# Altium schematic sheet Sheet1.SchDoc
size A4; SheetNumber: 1; SheetTotal: 1; SPICEModelCacheIDHECYRS: <root> / <DocumentId>IDHECYRS</DocumentId> / <CacheFrame Number="0"> / <Model Name="led0" Kind="MDL"> / <Text>*Typ INFRARED GaAs LED: Vf=1.2V Vr=5V If=40mA trr=3uS / *LED Pinout: 1=A, 2=K / .MODEL LED0 D (IS=93.5P RS=84M N=2.63 BV=5 IBV=10U / + CJO=2.97P VJ=.75 M=.333 TT=4.32U)</Text> / </Model> / </CacheFrame> / </root>
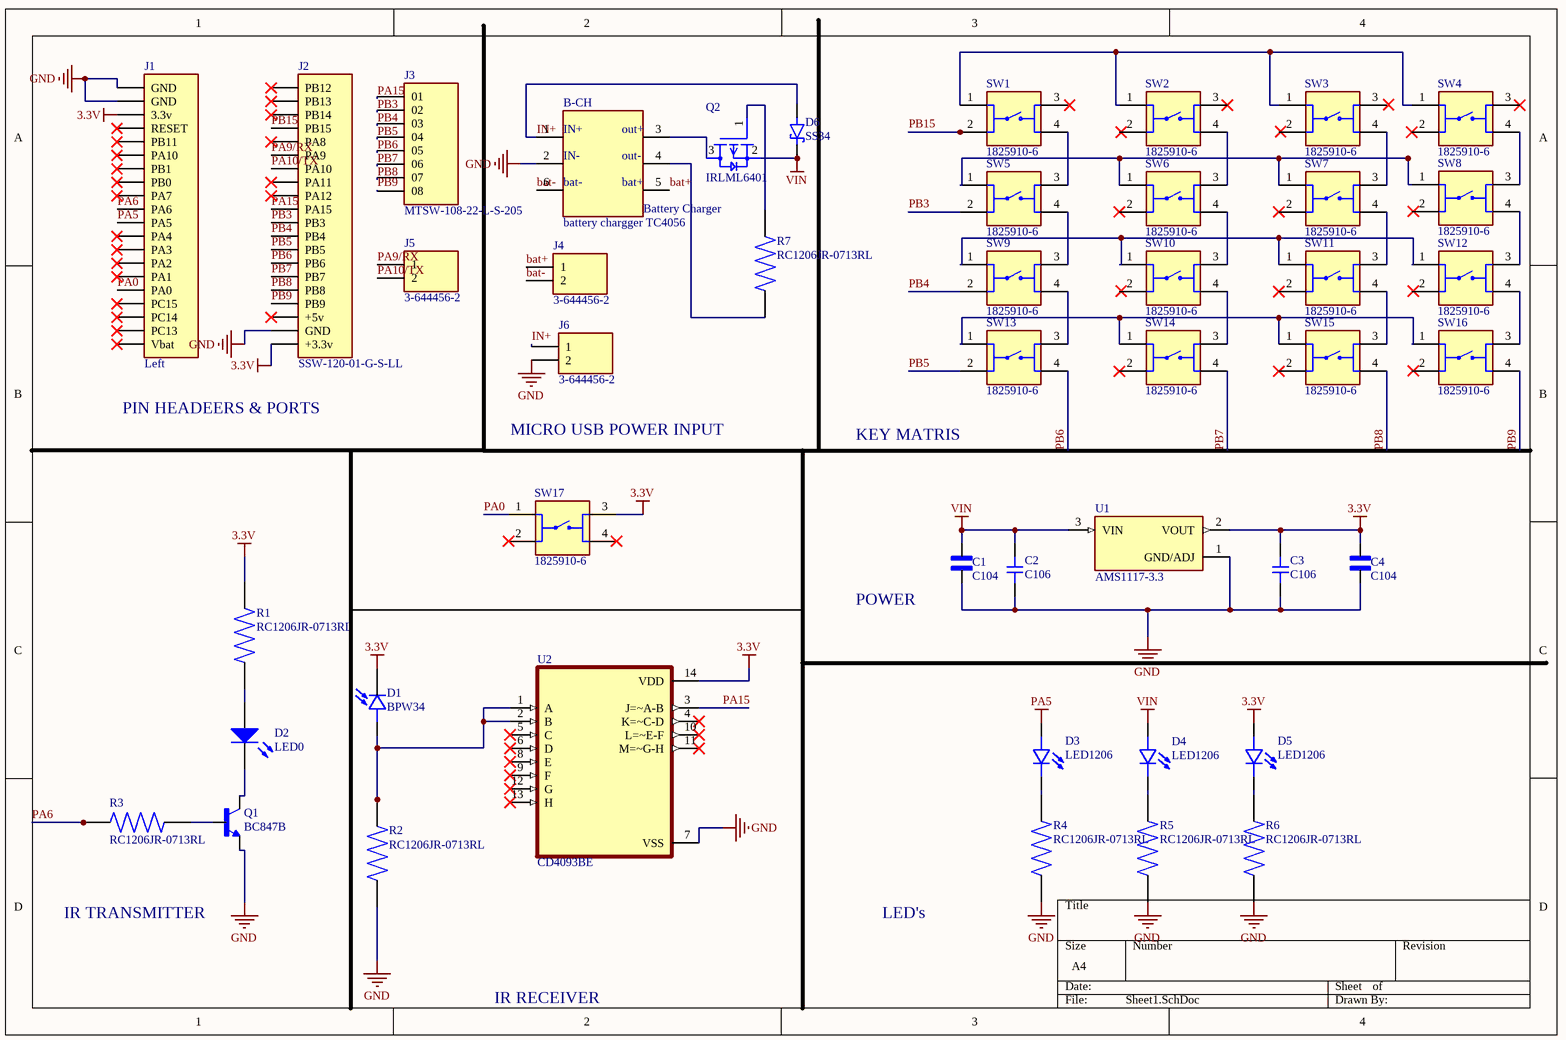
[diagram p0: Sheet1.SchDoc]

## Parts
B-CH  battery chargger TC4056  [battery charger TC4056]
C1  C104  [CAPC2012X88N]
C2  C106  [CAPC3216X120N]
C3  C106  [CAPC3216X120N]
C4  C104  [CAPC2012X88N]
D1  BPW34  [DIO_BPW34]
D2  LED0  [LED-0]
D3  LED1206  [LEDC3216X120N]
D4  LED1206  [LEDC3216X120N]
D5  LED1206  [LEDC3216X120N]
D6  SS34  [DIOM7959X265N]
J1  Left  [SAMTEC_SSW-120-01-G-S-LL]
J2  SSW-120-01-G-S-LL  [SAMTEC_SSW-120-01-G-S-LL]
J3  MTSW-108-22-L-S-205  [SAMTEC_MTSW-108-22-L-S-205]
J4  3-644456-2  [TE_3-644456-2]
J5  3-644456-2  [TE_3-644456-2]
J6  3-644456-2  [TE_3-644456-2]
Q1  BC847B  [SOT100P230X110-3N]
Q2  IRLML6401  [SOT23-3]
R1  RC1206JR-0713RL  [RESC3116X65N]
R2  RC1206JR-0713RL  [RESC3116X65N]
R3  RC1206JR-0713RL  [RESC3116X65N]
R4  RC1206JR-0713RL  [RESC3116X65N]
R5  RC1206JR-0713RL  [RESC3116X65N]
R6  RC1206JR-0713RL  [RESC3116X65N]
R7  RC1206JR-0713RL  [RESC3116X65N]
SW1  1825910-6  [SW_1825910-6-4]
SW2  1825910-6  [SW_1825910-6-4]
SW3  1825910-6  [SW_1825910-6-4]
SW4  1825910-6  [SW_1825910-6-4]
SW5  1825910-6  [SW_1825910-6-4]
SW6  1825910-6  [SW_1825910-6-4]
SW7  1825910-6  [SW_1825910-6-4]
SW8  1825910-6  [SW_1825910-6-4]
SW9  1825910-6  [SW_1825910-6-4]
SW10  1825910-6  [SW_1825910-6-4]
SW11  1825910-6  [SW_1825910-6-4]
SW12  1825910-6  [SW_1825910-6-4]
SW13  1825910-6  [SW_1825910-6-4]
SW14  1825910-6  [SW_1825910-6-4]
SW15  1825910-6  [SW_1825910-6-4]
SW16  1825910-6  [SW_1825910-6-4]
SW17  1825910-6  [SW_1825910-6-4]
U1  AMS1117-3.3  [SOT229P700X180-4N]
U2  CD4093BE  [DIP794W45P254L1969H508Q14]

## Nets
3.3V: C3.1(A) C4.1 D1.C D5.POS J1.03(3.3v) J2.?1(+3.3v) R1.2 SW17.3 U1.2(VOUT) U2.14(VDD)
GND: B-CH.2 C1.2 C2.2(B) C3.2(B) C4.2 J1.01(GND) J1.02(GND) J2.19(GND) J6.2 Q1.2(E) R2.1 R4.1 R5.1 R6.1 U1.1(GND/ADJ) U2.7(VSS)
PA5: D3.POS J1.11(PA5)
VIN: C1.1 C2.1(A) D4.POS D6.C(K) Q2.2(S) U1.3(VIN)
bat+: B-CH.5 J4.1
bat-: B-CH.6 J4.2
IN+: B-CH.1 D6.A J6.1
PA0: J1.16(PA0) SW17.1
PA6: J1.10(PA6) R3.2
PA9/RX: J2.06(PA9) J5.1
PA10/TX: J2.07(PA10) J5.2
PA15: J2.10(PA15) J3.01 U2.3(J=~A-B)
PB3: J2.11(PB3) J3.02 SW5.2
PB4: J2.12(PB4) J3.03 SW9.2
PB5: J2.13(PB5) J3.04 SW13.2
PB6: J2.14(PB6) J3.05 SW13.4
PB7: J2.15(PB7) J3.06 SW14.4
PB8: J2.16(PB8) J3.07 SW15.4
PB9: J2.17(PB9) J3.08 SW16.4
PB15: J2.04(PB15) SW1.2
NetB-CH_3: B-CH.3 Q2.3(D)
NetB-CH_4: B-CH.4 R7.1
NetD1_A: D1.A R2.2 U2.1(A) U2.2(B)
NetD2_1: D2.1(A) R1.1
NetD2_2: D2.2(K) Q1.3(C)
NetD3_NEG: D3.NEG R4.2
NetD4_NEG: D4.NEG R5.2
NetD5_NEG: D5.NEG R6.2
NetQ1_1: Q1.1(B) R3.1
NetQ2_1: Q2.1(G) R7.2
NetSW1_1: SW1.1 SW2.1 SW3.1 SW4.1
NetSW1_4: SW1.4 SW5.3
NetSW2_4: SW2.4 SW6.3
NetSW3_4: SW3.4 SW7.3
NetSW4_4: SW4.4 SW8.3
NetSW5_1: SW5.1 SW6.1 SW7.1 SW8.1
NetSW5_4: SW5.4 SW9.3
NetSW6_4: SW6.4 SW10.3
NetSW7_4: SW7.4 SW11.3
NetSW8_4: SW8.4 SW12.3
NetSW9_1: SW9.1 SW10.1 SW11.1 SW12.1
NetSW9_4: SW9.4 SW13.3
NetSW10_4: SW10.4 SW14.3
NetSW11_4: SW11.4 SW15.3
NetSW12_4: SW12.4 SW16.3
NetSW13_1: SW13.1 SW14.1 SW15.1 SW16.1

Not connected (* = marked no-connect by the designer): J1 04(RESET)* 05(PB11)* 06(PA10)* 07(PB1)* 08(PB0)* 09(PA7)* 12(PA4)* 13(PA3)* 14(PA2)* 15(PA1)* 17(PC15)* 18(PC14)* 19(PC13)* 20(Vbat)*; J2 01(PB12)* 02(PB13)* 03(PB14)* 05(PA8)* 08(PA11)* 09(PA12)* 18(+5v)*; SW1 3; SW2 2 3*; SW3 2 3; SW4 2* 3*; SW6 2*; SW7 2*; SW8 2; SW10 2; SW11 2*; SW12 2; SW14 2*; SW15 2*; SW16 2; SW17 2* 4*; U2 4(K=~C-D)* 5(C)* 6(D)* 8(E)* 9(F)* 10(L=~E-F)* 11(M=~G-H)* 12(G)* 13(H)*

## Notes on the sheet
- PIN HEADEERS & PORTS
- MICRO USB POWER INPUT
- KEY MATRIS
- POWER
- IR TRANSMITTER
- LED's
- IR RECEIVER
- (in symbol battery chargger TC4056) IN+; out+; IN-; out-; bat-; bat+; Battery Charger

## Library data of the parts
C1 C4 = C0805C475K3PACTU: Capacitor;Ceramic;Cap 4.7uF;Tol+10%;SMT;Vol-Rtg 25V;X5R;TR | KEMET C0805C475K3PACTU; SnapEDA_Link: https://www.snapeda.com/parts/C0805C475K3PACTU/KEMET/view-part/?ref=snap; Package: 0805 Kemet; Value: *; MF: KEMET; MP: C0805C475K3PACTU; Check_prices: https://www.snapeda.com/parts/C0805C475K3PACTU/KEMET/view-part/?ref=eda
C2 C3 = C1206C105K5RACTU: 1206 C 1uF Ceramic Multilayer Capacitor, 50 VDC, +125degC, X7R Dielec, +/-10% | KEMET C1206C105K5RACTU; SnapEDA_Link: https://www.snapeda.com/parts/C1206C105K5RACTU/KEMET/view-part/?ref=snap; Package: 1206-2 KEMET; Value: *; MF: KEMET; MP: C1206C105K5RACTU; Check_prices: https://www.snapeda.com/parts/C1206C105K5RACTU/KEMET/view-part/?ref=eda
D1 = BPW34: Photodiode 850nm 20ns 120Â° 2-DIP (0.213, 5.40mm); MF: OSRAM Opto Semiconductors; SnapEDA_Link: https://www.snapeda.com/parts/BPW%2034/OSRAM/view-part/?ref=snap; Package: SMD-2 OSRAM Opto Semiconductors; Value: *; MP: BPW 34; Check_prices: https://www.snapeda.com/parts/BPW%2034/OSRAM/view-part/?ref=eda
D2 = LED0: Typical INFRARED GaAs LED; Published: 8-Jun-2000; LatestRevisionDate: 08-Jul-2005; LatestRevisionNote: Mech Layer 1 removed.; PackageReference: LED-0; Publisher: Altium Limited
D3-D5 = LHN974_RED_LED_1206: 2.6 V Red LED SMD; MF: Osram; MP: LHN974 RED LED 1206; SnapEDA_Link: https://www.snapeda.com/parts/LHN974%20RED%20LED%201206/Osram/view-part/?ref=snap; Package: None; Value: *; Check_prices: https://www.snapeda.com/parts/LHN974%20RED%20LED%201206/Osram/view-part/?ref=eda
D6 = SS34: Diode Schottky 40 V 3A Surface Mount SMC (DO-214AB); MF: onsemi; SnapEDA_Link: https://www.snapeda.com/parts/SS34/Onsemi/view-part/?ref=snap; Package: SMC-2 ON Semiconductor; Value: *; MP: SS34; Check_prices: https://www.snapeda.com/parts/SS34/Onsemi/view-part/?ref=eda
J1 J2 = SSW-120-01-G-S-LL: MF: Samtec; Value: *; Price: None; Availability: Unavailable; Package: None; MP: SSW-120-01-G-S-LL
J4-J6 = 3-644456-2: HEADER ASSEMBLY, NARROW, MTA-100, 2 POSITION, STRAIGHT | TE Connectivity 3-644456-2; SnapEDA_Link: https://www.snapeda.com/parts/3-644456-2/TE+Connectivity+AMP+Connectors/view-part/?ref=snap; Package: None; Value: *; MF: TE Connectivity; MP: 3-644456-2; Check_prices: https://www.snapeda.com/parts/3-644456-2/TE+Connectivity+AMP+Connectors/view-part/?ref=eda
Q1 = BC847B: Bipolar (BJT) Transistor NPN 45V 100mA 100MHz 150mW Surface Mount SOT-523; Package: None; Price: None; Availability: Unavailable; MP: BC847B; Value: *
Q2 = IRLML6401: P-Channel 12V 4.3A (Ta) 1.3W (Ta) Surface Mount Micro3â„¢/SOT-23; MF: International Rectifier; Package: SOT-23 International Rectifier; MP: IRLML6401; Value: *; Check_prices: https://www.snapeda.com/parts/IRLML6401/International%20Rectifier/view-part/557178/?ref=eda; Price: None; SnapEDA_Link: https://www.snapeda.com/parts/IRLML6401/International%20Rectifier/view-part/557178/?ref=snap; Availability: Unavailable
R1-R7 = RC1206JR-0713RL: 13 Ohms Â±5% 0.25W, 1/4W Chip Resistor 1206 (3216 Metric) Moisture Resistant Thick Film; MF: Yageo; Check_prices: https://www.snapeda.com/parts/RC1206JR-0713RL/Yageo/view-part/?ref=eda; Value: *; Availability: In Stock; MP: RC1206JR-0713RL; Price: None; Package: 3116 Yageo; SnapEDA_Link: https://www.snapeda.com/parts/RC1206JR-0713RL/Yageo/view-part/?ref=snap; Purchase-URL: https://pricing.snapeda.com/search/part/RC1206JR-0713RL/?ref=eda
SW1-SW17 = 1825910-6: Switch Push Button OFF (ON) SPST Round Button 0.05A 24VDC Momentary Contact PC Pins Thru-Hole; MF: TE Connectivity; Value: *; MP: 1825910-6; Package: None; Check_prices: https://www.snapeda.com/parts/1825910-6/TE+Connectivity+ALCOSWITCH+Switches/view-part/?ref=eda; SnapEDA_Link: https://www.snapeda.com/parts/1825910-6/TE+Connectivity+ALCOSWITCH+Switches/view-part/?ref=snap; Digi-Key_Part_Number: 450-1650-ND; Purchase-URL: https://pricing.snapeda.com/search/part/1825910-6/?ref=eda
U1 = AMS1117-3.3: Sot223/Pkg 1-Amp 3.3-Volt Low Drop Out Voltage Regulatator; MF: Advanced Monolithic Systems; SnapEDA_Link: https://www.snapeda.com/parts/AMS1117-3.3/Advanced+Monolithic+Systems/view-part/?ref=snap; Package: SOT-223 Seeed Technology; Value: *; MP: AMS1117-3.3; Check_prices: https://www.snapeda.com/parts/AMS1117-3.3/Advanced+Monolithic+Systems/view-part/?ref=eda
U2 = CD4093BE: 4-ch, 2-input, 3-V to 18-V NAND gates with Schmitt-Trigger inputs; MF: Texas Instruments; SnapEDA_Link: https://www.snapeda.com/parts/CD4093BE/Texas+Instruments/view-part/?ref=snap; Package: PDIP-14 Texas Instruments; Value: *; MP: CD4093BE; Check_prices: https://www.snapeda.com/parts/CD4093BE/Texas+Instruments/view-part/?ref=eda
J3 = MTSW-108-22-L-S-205: Availability: Unavailable; Package: None; Price: None; Value: *; MP: MTSW-108-22-L-S-205